# EAGLE design Pulse Generator (EAGLE 8.7.0)
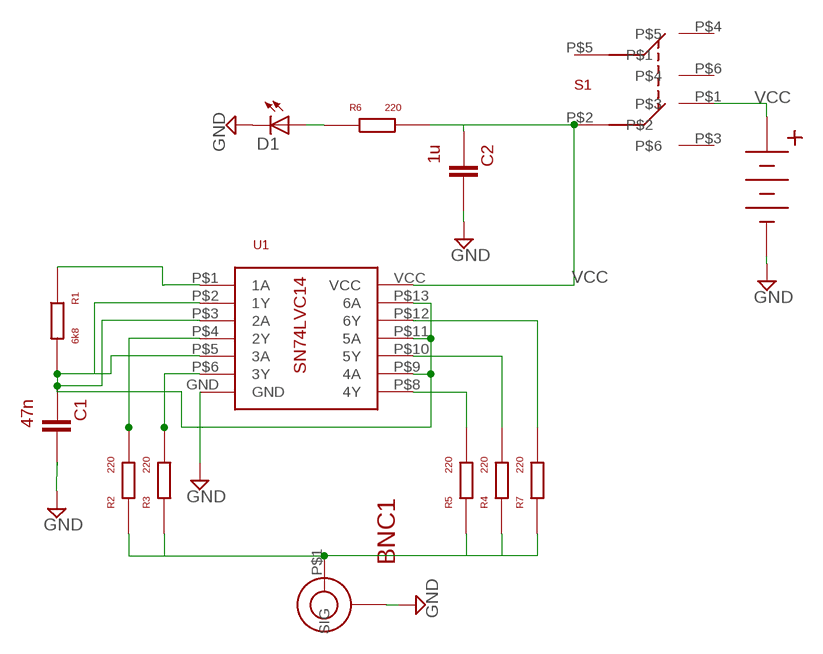
[diagram p0: schematic, sheet 1]

## Parts
BNC1  TE-1-337543  [PCBBNC]
C1  47n  1206LED  [1206CAP]
C2  1u  1206LED  [1206CAP]
D1  1206LEDDIODE  [1206]
R1  6k8  1206RESISTOR  [1206]
R2  220  1206RESISTOR  [1206]
R3  220  1206RESISTOR  [1206]
R4  220  1206RESISTOR  [1206]
R5  220  1206RESISTOR  [1206]
R6  220  1206RESISTOR  [1206]
R7  220  1206RESISTOR  [1206]
S1  JS202011SCQN  [JS202011SCQN]
U1  SN74LVC14A  [SOIC-14]
U$1  1042-18650BATTERYHOLE  [BATTHRHOLE]

## Nets
GND: BNC1.P$2(GND) C1.P$1 C2.P$1 D1.P$2(C) U1.GND U$1.GND
N$1: R3.P$1 U1.P$6(3Y)
N$2: R2.P$1 U1.P$4(2Y)
N$4: R5.P$1 U1.P$8(4Y)
N$6: R4.P$1 U1.P$10(5Y)
N$7: R7.P$1 U1.P$12(6Y)
N$13: BNC1.P$1(SIG) R2.P$2 R3.P$2 R4.P$2 R5.P$2 R7.P$2
N$18: C1.P$2 R1.P$1 U1.P$2(1Y) U1.P$3(2A) U1.P$5(3A) U1.P$9(4A) U1.P$11(5A) U1.P$13(6A)
N$23: D1.P$1(A) R6.P$2
N$32: R1.P$2 U1.P$1(1A)
VCC: C2.P$2 R6.P$1 S1.P$1 S1.P$2 U1.VCC U$1.VCC
Unconnected: S1.P$3 S1.P$4 S1.P$5 S1.P$6

## Library data of the parts
BNC1 = PCBBNC:TE-1-337543: TE-1-1337543-0 - PCB to BNC Right Angle Connector Specifications Manufacturer: TE Connectivity Connector: BNC Gender: Jack Impedance: 50 Ohms Mouser: TE-1-1337543-0 <https://www.mouser.com/ProductDetail/TE-Connectivity-AMP/1-1337543-0?qs=sGAEpiMZZMuLQf%252bEuFsOrkN5sFI71Kzav1a2hPGpKm8%3d>
C1 C2 = 1206CAP:1206LED
D1 = 1206LED:1206LED
R1-R7 = 1206 Resistor:1206RESISTOR: Bourns CR1206 - 1206 Resistor Manufacturer: Bourns Series: CR1206 Power Rating: 250 mW Tolerance: 1% Mouser: CR1206 <https://www.mouser.com/ProductDetail/Bourns/CR1206-FX-6801ELF?qs=sGAEpiMZZMtlubZbdhIBIK83tcUYgy7Iyiq0v%2f0IFwE%3d>
S1 = JS202011SCQN:JS202011SCQN: JS202011SCQN - PCB DPDT Switch Specifications Manufacturer: C&K Switches Contact Form: DPDT Mounting Style: SMD Contact Current Rating: .3A/6V Mouser Part #: 611-JS202011SCQN <https://www.mouser.com/ProductDetail/CK/JS202011SCQN?qs=sGAEpiMZZMtHXLepoqNyVVoF19TbJQED2X%252bXJwW5kR8%3d>
U1 = Nathan Library:SN74LVC14A: SN74LVC14A - Hex Schmitt-Trigger Inverter Specifications Manufacturer: Texas Instruments Manufacturer PN: SN74LVC14ADR Input Voltage: 2- 3.6 V Mouser #: 595-SN74LVC14ADR
U$1 = 1042-18650Battery:1042-18650BATTERY

## Board
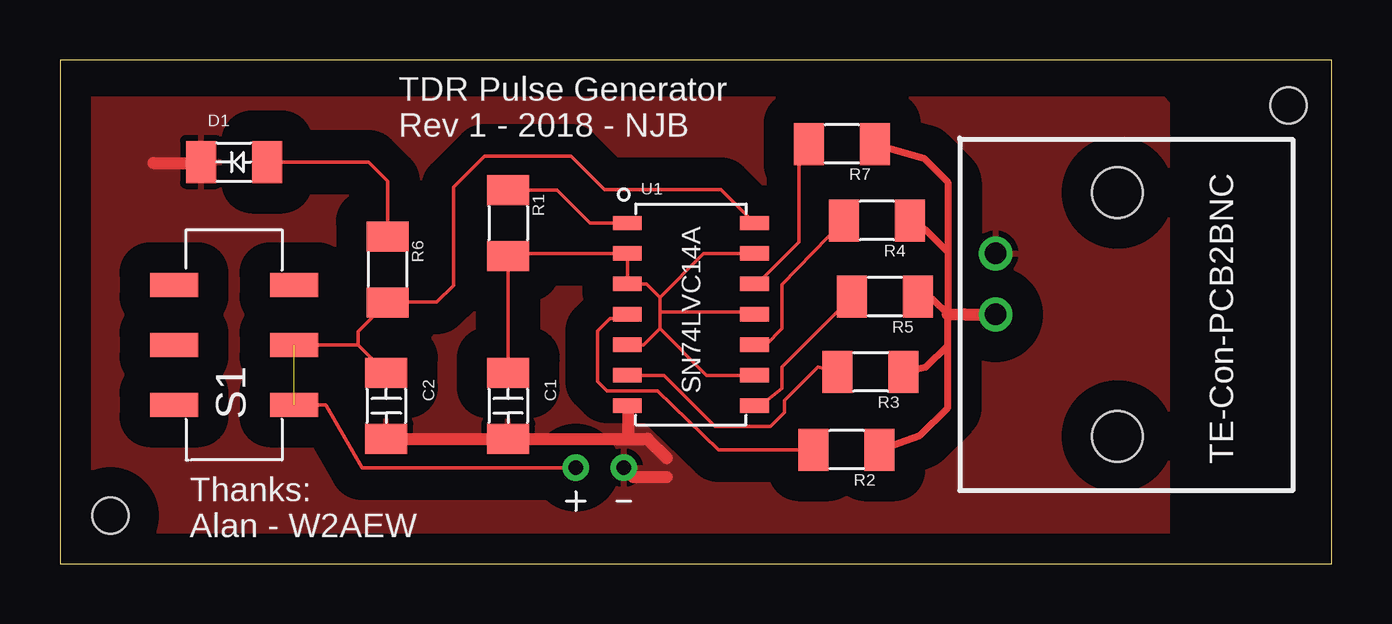
[diagram p1: board, top side]

Size 53 x 21 mm. Coordinates in mm from the lower left corner, seen from the top.
Outline: 0,0 53,0 53,21 0,21 0,0
Copper layers (1*16): Top 0.035mm / dielectric 1.5mm / Bottom 0.035mm
Design rules "default *": minimum track width 6mil, minimum drill 0.35mm, track to track 6mil, track to pad 6mil, pad to pad 6mil, via to via 6mil, smd to smd 6mil, copper to edge 5mil, drill to drill 6mil, minimum pad ring 10mil, minimum via ring 8mil, stop-mask expansion 4mil, vias tented up to drill 0mil, thermal gap 10mil
Holes 1.5 mm at 2.1,2 51.2,19.1

### Footprints (pad centres in the part's own frame; a part is rotated, then mirrored left to right if it is on the bottom)
PCBBNC = drill 0.9: P$1 0,0; P$2 -2.54,0 | hole 2.11: -5.08,5.08; 5.08,5.08
1206CAP = smd 1.25 x 1.75: P$1 1.375,0; P$2 -1.375,0
1206 = smd 1.25 x 1.75: P$1 1.375,0; P$2 -1.375,0
JS202011SCQN = smd 1 x 2: P$1 -2.5,-2.5; P$2 0,-2.5; P$3 2.5,-2.5; P$4 -2.5,2.5; P$5 0,2.5; P$6 2.5,2.5
SOIC-14 = smd 1.2 x 0.6: GND -2.65,-3.81; P$1 -2.65,3.81; P$2 -2.65,2.54; P$3 -2.65,1.27; P$4 -2.65,0; P$5 -2.65,-1.27; P$6 -2.65,-2.54; P$8 2.65,-3.81; P$9 2.65,-2.54; P$10 2.65,-1.27; P$11 2.65,0; P$12 2.65,1.27; P$13 2.65,2.54; VCC 2.65,3.81
BATTHRHOLE = drill 0.6: GND -1,0; VCC 1,0

### Placement (x,y rotation side)
BNC1  39,10.39 270 top
C1  18.68,6.58 270 top
C2  13.6,6.58 270 top
D1  7.25,16.74 0 top
R1  18.68,14.2 270 top
R2  32.79,4.75 180 top
R3  33.79,7.99 180 top
R4  34.05,14.31 180 top
R5  34.39,11.13 180 top
R6  13.65,12.27 270 top
R7  32.6,17.5 180 top
S1  7.25,9.12 90 top
U1  26.3,10.39 0 top
U$1  22.5,4 180 top

### Tracks (layer width: path | path; a pad name or v marks a point on that pad's centre or on a via)
GND
  Top 0.152: 5.9,16.7 6,16.6 | 23.7,6.53 U1.GND
  Top 0.5: 25.3,3.6 23.9,3.6 U$1.GND | 3.9,16.7 5.9,16.7 | C2.P$1 C1.P$1 23.7,5.21 | 23.7,5.21 24.49,5.21 25.3,4.4 | 23.7,5.21 23.7,6.53
  pour Top (isolate 1.27): 1,0.4 1,19.4 46,19.4 46.2,19.2 46.2,0.4
N$1
  Top 0.152: R3.P$1 31.59,8.19 30.2,6.8 30.2,6.3 29.62,5.72 27.3,5.72 25.17,7.85 U1.P$6
N$2
  Top 0.152: R2.P$1 27.45,4.75 24.9,7.2 22.8,7.2 22.4,7.6 22.4,9.7 22.92,10.22 23.48,10.22 U1.P$4
N$4
  Top 0.152: U1.P$8 29.18,6.58 30.1,7.3 30.1,8.2 32.41,10.52 R5.P$1
N$6
  Top 0.152: 29.5,9.2 29.03,9.2 U1.P$10 29.42,9.12 30.1,9.8 30.1,11.63 R4.P$1
N$7
  Top 0.152: R7.P$1 30.8,16.57 30.8,13.4 29.06,11.66 U1.P$12
N$13
  Top 0.152: 39,10.29 BNC1.P$1
  Top 0.3: R7.P$2 36,16.9 37,15.9 37,13 | 37,13 37,10.4 | R2.P$2 35.85,5.35 37,6.5 37,9.1 | 37,9.1 37,10.4 | R3.P$2 36.09,8.19 37,9.1 | R4.P$2 36.09,13.91 37,13 | R5.P$2 36.37,11.03 37,10.4
  Top 0.5: BNC1.P$1 37.71,10.39 37,10.4
N$18
  Top 0.152: C1.P$2 18.68,12.7 | 18.68,12.7 R1.P$1 | 18.68,12.7 18.91,12.93 U1.P$2 U1.P$3 24.44,11.66 25,11.1 | U1.P$5 24.32,9.12 25,9.8 | 25,11.1 25,10.5 | 25,10.5 25,9.8 | U1.P$9 26.95,7.85 25,9.8 | U1.P$11 28.84,10.5 25,10.5 | U1.P$13 26.83,12.93 25,11.1
N$23
  Top 0.152: R6.P$2 13.65,15.95 12.86,16.74 D1.P$1
N$32
  Top 0.152: R1.P$2 20.72,15.57 22.1,14.2 U1.P$1
VCC  (1 unrouted)
  Top 0.152: U$1.VCC 12.6,4 11.1,6.6 11.08,6.62 S1.P$1 | S1.P$2 12.44,9.12 | 12.44,9.12 C2.P$2 | 12.44,9.12 12.44,9.68 R6.P$1 15.7,10.9 16.4,11.6 16.4,15.7 17.7,17 21.3,17 22.7,15.6 27.55,15.6 U1.VCC

### Text on the board
tPlace: TDR Pulse Generator / Rev 1 - 2018 - NJB | SN74LVC14A | Thanks: / Alan - W2AEW